# EAGLE design paperclick_v1 (EAGLE 9.6.2)
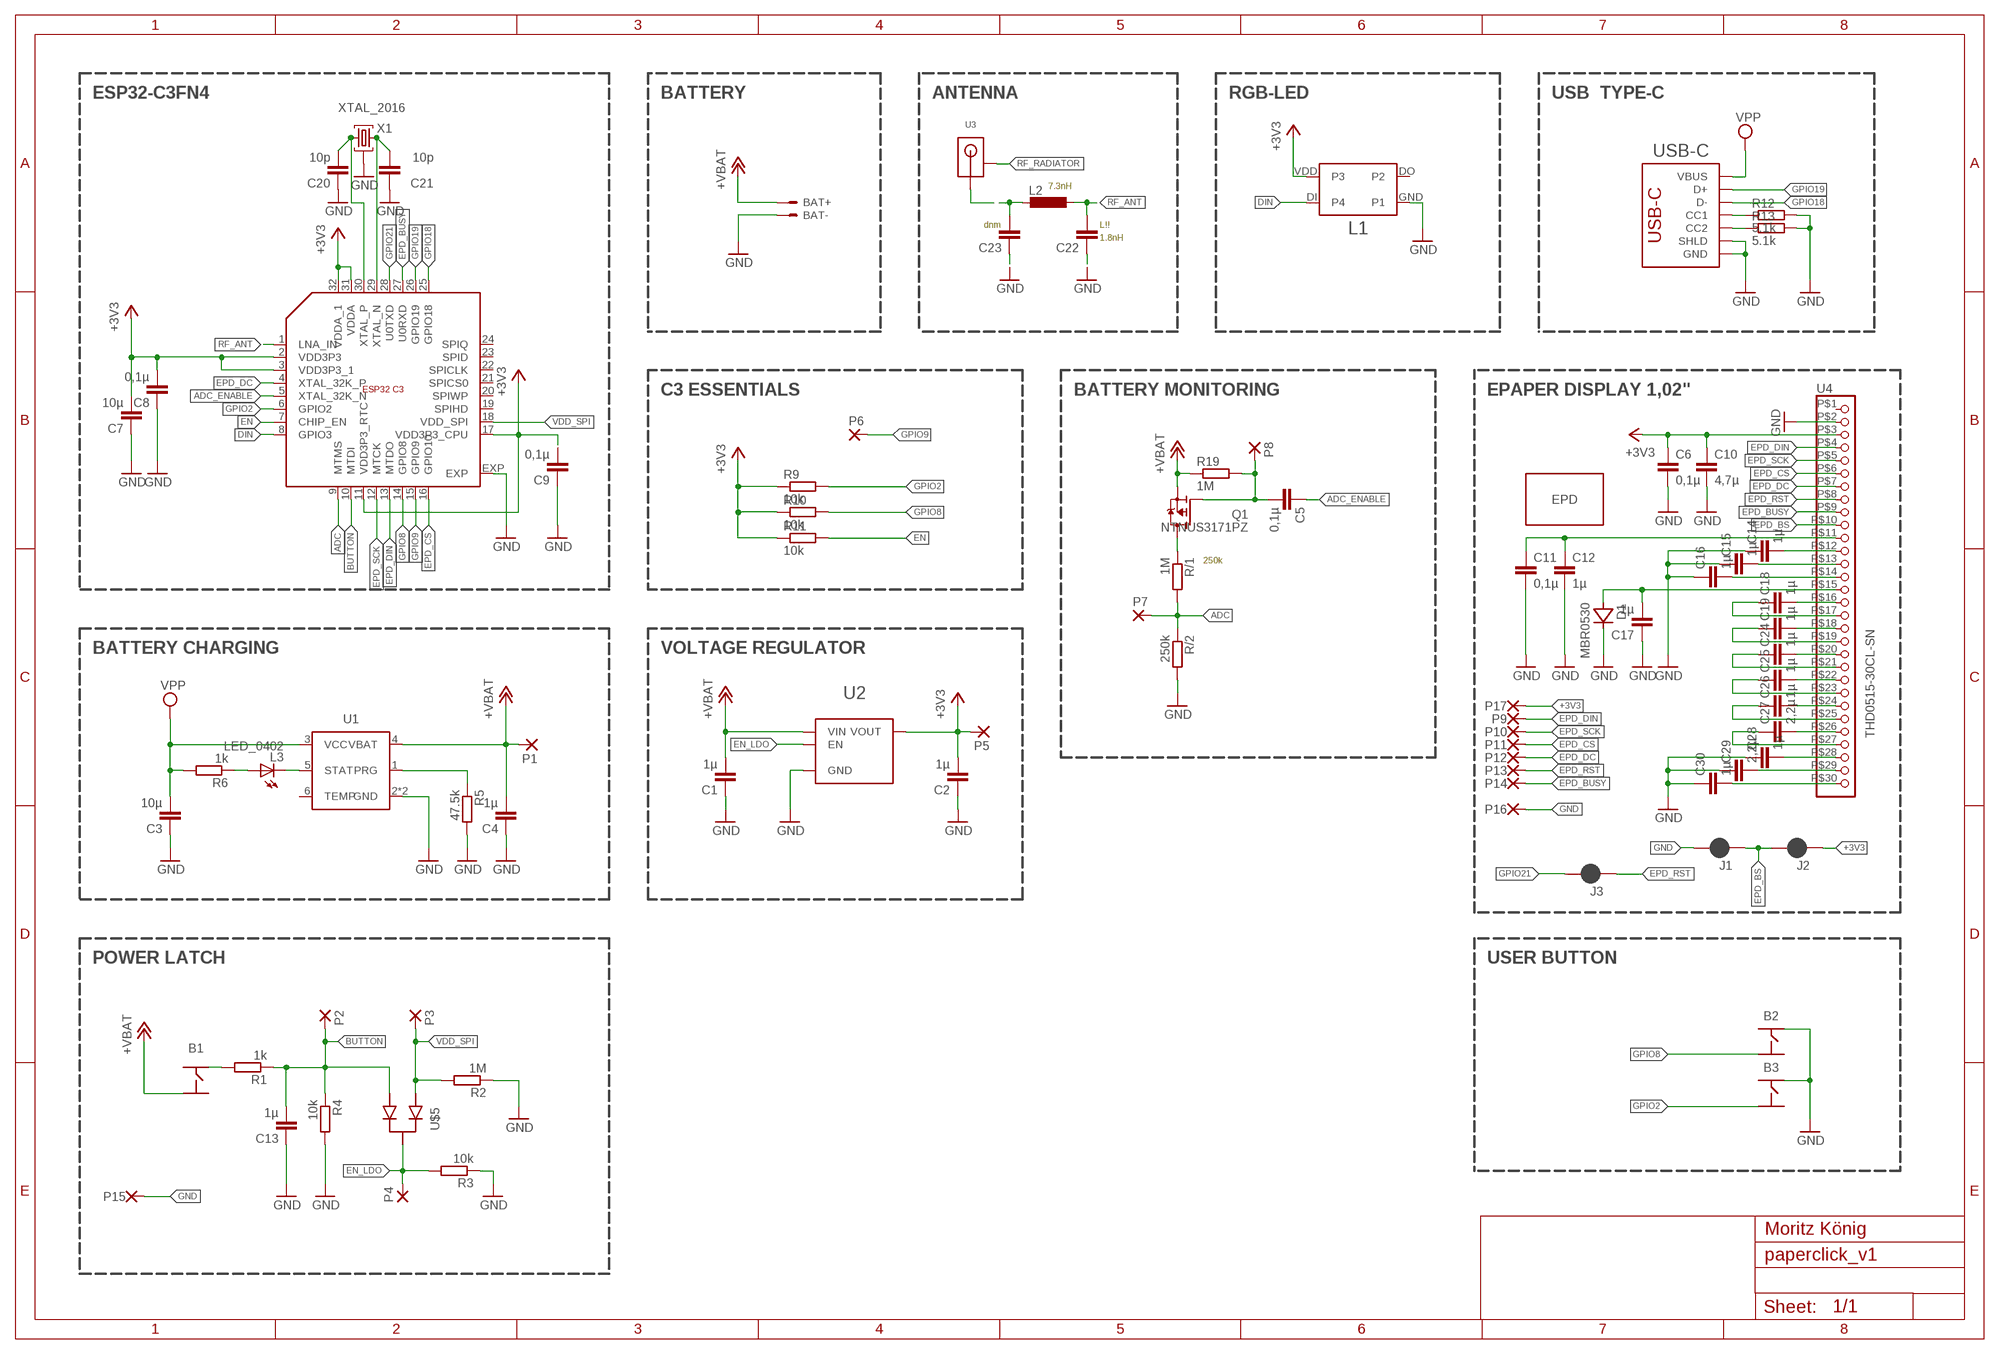
[diagram p0: schematic, sheet 1]

## Parts
B1  BUTTON_4PIN_TS-1070A  [BUTTON_WHITE_SMD]
B2  PTS840ESDGMSMTRLFS  [PTS840ESDGMSMTRLFS]
B3  PTS840ESDGMSMTRLFS  [PTS840ESDGMSMTRLFS]
BAT+  TP/SP-1.5X1.0  [SOLDERPAD_1.5X1.0]
BAT-  TP/SP-1.5X1.0  [SOLDERPAD_1.5X1.0]
C1  1µ  C0402_S  [C0402_S]
C2  1µ  C0402_S  [C0402_S]
C3  10µ  C0402_S  [C0402_S]
C4  1µ  C0402_S  [C0402_S]
C5  0,1µ  C0402_S  [C0402_S]
C6  0,1µ  C0402_S  [C0402_S]
C7  10µ  C0402_S  [C0402_S]
C8  0,1µ  C0402_S  [C0402_S]
C9  0,1µ  C0402_S  [C0402_S]
C10  4,7µ  C0402_S  [C0402_S]
C11  0,1µ  C0402_S  [C0402_S]
C12  1µ  C0402_S  [C0402_S]
C13  1µ  C0402_S  [C0402_S]
C14  1µ  C0402_S  [C0402_S]
C15  1µ  C0402_S  [C0402_S]
C16  1µ  C0402_S  [C0402_S]
C17  1µ  C0402_S  [C0402_S]
C18  1µ  C0402_S  [C0402_S]
C19  1µ  C0402_S  [C0402_S]
C20  10p  C0402_S  [C0402_S]
C21  10p  C0402_S  [C0402_S]
C22  C0201  [C0201]
C23  C0201  [C0201]
C24  1µ  C0402_S  [C0402_S]
C25  1µ  C0402_S  [C0402_S]
C26  1µ  C0402_S  [C0402_S]
C27  2,2µ  C0402_S  [C0402_S]
C28  1µ  C0402_S  [C0402_S]
C29  2,2µ  C0402_S  [C0402_S]
C30  1µ  C0402_S  [C0402_S]
D1  MBR0530  MBR0520  [SOD123]
ESP1  ESP32_C3_QFN32  [QFN32]
J1  SMT_JUMPER_2_NC_PASTE  [JUMPER_SMALL]
J2  SMT_JUMPER_2_NC_PASTE  [JUMPER_SMALL]
J3  SMT_JUMPER_2_NC_PASTE  [JUMPER_SMALL]
L1  WS2812_2020  [WS2812_2020]
L2  L0201  [L0201]
L3  LED_0402  [CHIPLED_0402]
P1  SMD-R1  [SMD-R1]
P2  SMD-R1  [SMD-R1]
P3  SMD-R1  [SMD-R1]
P4  SMD-R1  [SMD-R1]
P5  SMD-R1  [SMD-R1]
P6  SMD-R1  [SMD-R1]
P7  SMD-R1  [SMD-R1]
P8  SMD-R1  [SMD-R1]
P9  SMD-R1  [SMD-R1]
P10  SMD-R1  [SMD-R1]
P11  SMD-R1  [SMD-R1]
P12  SMD-R1  [SMD-R1]
P13  SMD-R1  [SMD-R1]
P14  SMD-R1  [SMD-R1]
P15  SMD-R1  [SMD-R1]
P16  SMD-R1  [SMD-R1]
P17  SMD-R1  [SMD-R1]
Q1  NTNUS3171PZ  [SOT1123]
R1  1k  R0402  [R0402]
R2  1M  R0402  [R0402]
R3  10k  R0402  [R0402]
R4  10k  R0402  [R0402]
R5  47.5k  R0402  [R0402]
R6  1k  R0402  [R0402]
R9  10k  R0402  [R0402]
R10  10k  R0402  [R0402]
R11  10k  R0402  [R0402]
R12  5.1k  R0402  [R0402]
R13  5.1k  R0402  [R0402]
R19  1M  R0402  [R0402]
R/1  1M  R0402  [R0402]
R/2  250k  R0402  [R0402]
U1  WS4518D  [DFN-6]
U2  MIC5504  [TDFN4]
U3  ANT016008LCS2442MA2  [ANT016008LCS2442MA2]
U4  THD0515-30CL-SN  [THD0515-30CL-SN]
U$2  EPD-102-30PIN-TW  [EPD-102-30PIN-TW]
U$5  DAN222  [SOT523]
USB-C  USB_C_C393939  [USBC_C393939]
X1  XTAL_2016  [XTAL_2016]

## Nets
+3V3: C2.P$2 C6.P$1 C7.P$2 C8.P$2 C9.P$2 C10.P$1 ESP1.2(VDD3P3) ESP1.3(VDD3P3_1) ESP1.11(VDD3P3_RTC) ESP1.17(VDD3P3_CPU) ESP1.31(VDDA) ESP1.32(VDDA_1) J2.P$1 L1.VDD(P3) P5.P$1(P) P17.P$1(P) R9.1 R10.1 R11.1 U2.P1(VOUT) U4.P$3
+VBAT: B1.P$2 BAT+.1(S) C1.P$2 C4.P$2 P1.P$1(P) Q1.2(S) R19.1 U1.4(VBAT) U2.P4(VIN)
ADC: ESP1.9(MTMS) P7.P$1(P) R/1.2 R/2.1
ADC_ENABLE: C5.P$1 ESP1.5(XTAL_32K_N)
BUTTON: C13.P$2 ESP1.10(MTDI) P2.P$1(P) R1.1 R4.1 U$5.2
DIN: ESP1.8(GPIO3) L1.DI(P4)
EN: ESP1.7(CHIP_EN) R11.2
EN_LDO: P4.P$1(P) R3.2 U2.P3(EN) U$5.3
EPD_BS: J1.P$1 J2.P$2 U4.P$10
EPD_BUSY: ESP1.27(U0RXD) P14.P$1(P) U4.P$9
EPD_CS: ESP1.16(GPIO10) P11.P$1(P) U4.P$6
EPD_DC: ESP1.4(XTAL_32K_P) P12.P$1(P) U4.P$7
EPD_DIN: ESP1.13(MTDO) P9.P$1(P) U4.P$4
EPD_RST: J3.P$1 P13.P$1(P) U4.P$8
EPD_SCK: ESP1.12(MTCK) P10.P$1(P) U4.P$5
GND: B2.2 B3.2 BAT-.1(S) C1.P$1 C2.P$1 C3.P$1 C4.P$1 C6.P$2 C7.P$1 C8.P$1 C9.P$1 C10.P$2 C11.P$2 C12.P$2 C13.P$1 C14.P$1 C15.P$1 C16.P$1 C17.P$1 C20.P$1 C21.P$1 C22.P$1 C23.P$1 C28.P$1 C29.P$1 C30.P$1 D1.P$2(C) ESP1.EXP J1.P$2 L1.GND(P1) P15.P$1(P) P16.P$1(P) R2.1 R3.1 R4.2 R5.2 R12.2 R13.2 R/2.2 U1.2(GND) U1.EXP(GND) U2.EXP(GND) U2.P2(GND) U4.P$2 USB-C.A1B12(GND) USB-C.B1A12(GND) USB-C.S1(SHLD) USB-C.S2(SHLD) USB-C.S3(SHLD) USB-C.S4(SHLD) X1.P2(G) X1.P4(G)
GPIO2: B3.3 ESP1.6(GPIO2) R9.2
GPIO8: B2.3 ESP1.14(GPIO8) R10.2
GPIO9: ESP1.15(GPIO9) P6.P$1(P)
GPIO18: ESP1.25(GPIO18) USB-C.A7(D-) USB-C.B7(D-)
GPIO19: ESP1.26(GPIO19) USB-C.A6(D+) USB-C.B6(D+)
GPIO21: ESP1.28(U0TXD) J3.P$2
N$1: B1.P$4 R1.2
N$2: L3.P$2(A) R6.1
N$3: L3.P$1(C) U1.5(STAT)
N$5: Q1.3(D) R/1.1
N$6: C23.P$2 L2.P$2 U3.3(ANT)
N$7: C5.P$2 P8.P$1(P) Q1.1(G) R19.2
N$18: R13.1 USB-C.B5(CC2)
N$19: C11.P$1 C12.P$1 U4.P$11
N$20: C14.P$2 U4.P$12
N$21: C15.P$2 U4.P$13
N$22: C16.P$2 U4.P$14
N$23: R5.1 U1.1(PRG)
N$24: C17.P$2 D1.P$1(A) U4.P$15
N$25: R12.1 USB-C.A5(CC1)
N$26: C20.P$2 ESP1.30(XTAL_P) X1.P1
N$27: C21.P$2 ESP1.29(XTAL_N) X1.P3
N$28: C18.P$2 U4.P$16
N$29: C18.P$1 U4.P$17
N$30: C19.P$2 U4.P$18
N$31: C19.P$1 U4.P$19
N$32: C24.P$2 U4.P$20
N$33: C24.P$1 U4.P$21
N$34: C25.P$2 U4.P$22
N$35: C25.P$1 U4.P$23
N$36: C26.P$2 U4.P$24
N$37: C26.P$1 U4.P$25
N$38: C27.P$2 U4.P$26
N$39: C27.P$1 U4.P$27
N$40: C28.P$2 U4.P$28
N$41: C29.P$2 U4.P$29
N$42: C30.P$2 U4.P$30
RF_ANT: C22.P$2 ESP1.1(LNA_IN) L2.P$1
RF_RADIATOR: U3.1(GND)
VDD_SPI: ESP1.18(VDD_SPI) P3.P$1(P) R2.2 U$5.1
VPP: C3.P$2 R6.2 U1.3(VCC) USB-C.A4B9(VBUS) USB-C.B4A9(VBUS)
Unconnected: B1.P$1 B1.P$3 B2.1 B2.4 B2.5 B3.1 B3.4 B3.5 ESP1.19(SPIHD) ESP1.20(SPIWP) ESP1.21(SPICS0) ESP1.22(SPICLK) ESP1.23(SPID) ESP1.24(SPIQ) L1.DO(P2) U1.6(TEMP) U4.P$1

## Notes on the sheet
- ESP32-C3FN4 | BATTERY | ANTENNA | RGB-LED | USB  TYPE-C
- 7.3nH
- dnm | L!!
- 1.8nH
- C3 ESSENTIALS | BATTERY MONITORING | EPAPER DISPLAY 1,02"
- 250k
- BATTERY CHARGING | VOLTAGE REGULATOR
- POWER LATCH | USER BUTTON
- Moritz König

## Library data of the parts
B1 = moekoe_switches:BUTTON_4PIN
B2 B3 = moekoe_switches:PTS840ESDGMSMTRLFS
BAT+ BAT- = iml_elc:TP/SP: Solderpads/Testpads
C1-C21 C24-C30 = moekoe_rcl:C0402
C22 C23 = moekoe_rcl:C0201
D1 = moekoe_discrete:MBR0520
ESP1 = moekoe_controllers:ESP32_C3_QFN32
J1-J3 = moekoe_pads_jumpers:SMT_JUMPER_2_NC_PASTE
L1 = moekoe_led:WS2812_2020
L2 = moekoe_rcl:L0201
L3 = moekoe_led:LED_0402
P1-P17 = moekoe_pads_jumpers:SMD-R1
Q1 = moekoe_discrete:NTNUS3171PZ
R1-R6 R9-R13 R19 R/1 R/2 = moekoe_rcl:R0402
U1 = moekoe_ics:WS4518D
U2 = moekoe_ics:MIC5504
U3 = moekoe_antennas:ANT016008LCS2442MA2
U4 = moekoe_hardware:THD0515-30CL-SN
U$2 = moekoe_displays:EPD-102-30PIN
U$5 = moekoe_discrete:DAN222
USB-C = moekoe_hardware:USB_C_C393939
X1 = moekoe_discrete:XTAL_2016

## Board
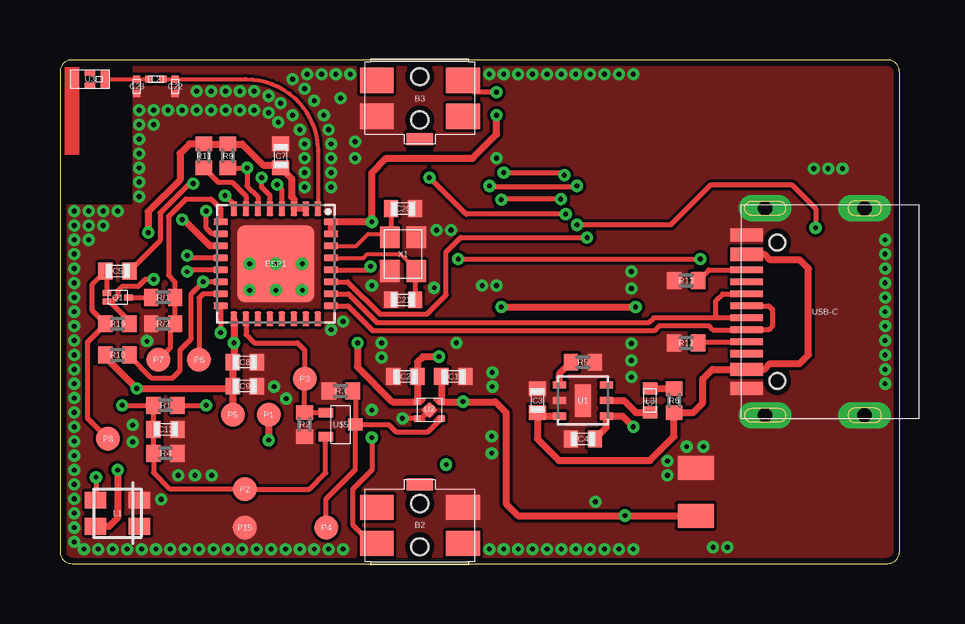
[diagram p1: board, top side]
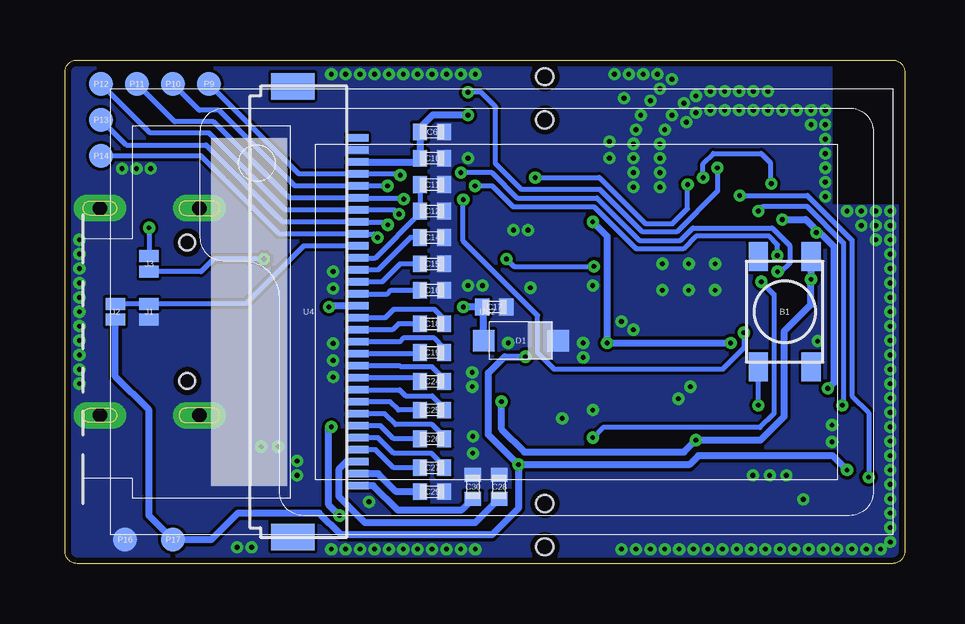
[diagram p2: board, bottom side, seen from below]

Size 35 x 21 mm. Coordinates in mm from the lower left corner, seen from the top.
Outline: 0.5,0 34.5,0 arc90 35,0.5 35,20.5 arc90 34.5,21 0.5,21 arc90 0,20.5 0,0.5 arc90 0.5,0
Copper layers (1*16): Top 0.035mm / dielectric 0.93mm / Bottom 0.035mm
Design rules "2020.08.24_4layers_eagle *": minimum track width 6mil, minimum drill 0.2mm, track to track 5mil, track to pad 4mil, pad to pad 4mil, via to via 5mil, smd to smd 0.1mm, copper to edge 10mil, drill to drill 6mil, minimum pad ring 10mil, minimum via ring 6mil, stop-mask expansion 0mil, vias tented up to drill 0.5mm, thermal gap 4mil
tRestrict: area 0,15 to 3,21
bRestrict: area 0,15 to 3,21

### Footprints (pad centres in the part's own frame; a part is rotated, then mirrored left to right if it is on the bottom)
BUTTON_WHITE_SMD = smd 1.2 x 0.8: P$1 2.3,1.1; P$2 2.3,-1.1; P$3 -2.3,-1.1; P$4 -2.3,1.1
PTS840ESDGMSMTRLFS = smd 1.4 x 1.05: 1 -1.8,0.75; 2 1.8,0.75; 3 -1.8,-0.75; 4 1.8,-0.75 | smd 1.1 x 0.5: 5 0,1.7 | hole 0.7: 0,0.9; 0,-0.9
SOLDERPAD_1.5X1.0 = smd 1 x 1.5: 1 0,0
C0402_S = smd 0.6 x 0.7: P$1 -0.5,0; P$2 0.5,0
C0201 = smd 0.3 x 0.3: P$1 -0.3,0; P$2 0.3,0
SOD123 = smd 0.9 x 0.9: P$1 -1.55,0; P$2 1.55,0
QFN32 = smd 0.6 x 0.275: 1 -2.3,1.75; 2 -2.3,1.25; 3 -2.3,0.75; 4 -2.3,0.25; 5 -2.3,-0.25; 6 -2.3,-0.75; 7 -2.3,-1.25; 8 -2.3,-1.75; 17 2.3,-1.75; 18 2.3,-1.25; 19 2.3,-0.75; 20 2.3,-0.25; 21 2.3,0.25; 22 2.3,0.75; 23 2.3,1.25; 24 2.3,1.75 | smd 0.275 x 0.6: 9 -1.75,-2.3; 10 -1.25,-2.3; 11 -0.75,-2.3; 12 -0.25,-2.3; 13 0.25,-2.3; 14 0.75,-2.3; 15 1.25,-2.3; 16 1.75,-2.3; 25 1.75,2.3; 26 1.25,2.3; 27 0.75,2.3; 28 0.25,2.3; 29 -0.25,2.3; 30 -0.75,2.3; 31 -1.25,2.3; 32 -1.75,2.3 | smd 3.2 x 3.2: EXP 0,0
JUMPER_SMALL = smd 0.5 x 0.8: P$1 -0.33,0; P$2 0.33,0
WS2812_2020 = smd 0.9 x 0.7: DI -0.915,0.55; DO 0.915,-0.55; GND 0.915,0.55; VDD -0.915,-0.55
L0201 = smd 0.3 x 0.3: P$1 -0.3,0; P$2 0.3,0
CHIPLED_0402 = smd 0.5 x 0.6: P$1 -0.5,0; P$2 0.5,0
SMD-R1 = smd 1 x 1: P$1 0,0
SOT1123 = smd 0.35 x 0.25: 1 -0.45,0.175; 2 -0.45,-0.175; 3 0.45,0
R0402 = smd 0.6 x 0.7: 1 -0.5,0; 2 0.5,0
DFN-6 = smd 0.55 x 0.3: 1 -0.975,0.65; 2 -0.975,0; 3 -0.975,-0.65; 4 0.975,-0.65; 5 0.975,0; 6 0.975,0.65 | smd 0.65 x 1.35: EXP 0,0
TDFN4 = smd 0.48 x 0.48 rotated 45: EXP 0,0 | smd 0.25 x 0.3: P1 -0.35,-0.5; P2 0.35,-0.5; P3 0.35,0.5; P4 -0.35,0.5
ANT016008LCS2442MA2 = smd 0.35 x 0.8: 1 -0.625,0; 3 0.625,0 | smd 0.45 x 0.2: 2 0,0.254; 4 0,-0.254
THD0515-30CL-SN = smd 0.9 x 0.3: P$1 0,7.25; P$2 0,6.75; P$3 0,6.25; P$4 0,5.75; P$5 0,5.25; P$6 0,4.75; P$7 0,4.25; P$8 0,3.75; P$9 0,3.25; P$10 0,2.75; P$11 0,2.25; P$12 0,1.75; P$13 0,1.25; P$14 0,0.75; P$15 0,0.25; P$16 0,-0.25; P$17 0,-0.75; P$18 0,-1.25; P$19 0,-1.75; P$20 0,-2.25; P$21 0,-2.75; P$22 0,-3.25; P$23 0,-3.75; P$24 0,-4.25; P$25 0,-4.75; P$26 0,-5.25; P$27 0,-5.75; P$28 0,-6.25; P$29 0,-6.75; P$30 0,-7.25 | smd 1.8 x 1.1: P$31 -2.7,-9.4; P$32 -2.7,9.4
SOT523 = smd 0.4 x 0.6: 1 0.5,0.62; 2 -0.5,0.62 | smd 0.5 x 0.6: 3 0,-0.62
USBC_C393939 = smd 0.55 x 1.35: A1B12 -3.2,0.775; A4B9 -2.4,0.775; B1A12 3.2,0.775; B4A9 2.4,0.775 | smd 0.275 x 1.35: A5 -1.25,0.775; A6 -0.25,0.775; A7 0.25,0.775; B5 1.75,0.775; B6 0.75,0.775; B7 -0.75,0.775; B8 1.25,0.775 | smd 0.3 x 1.35: A8 -1.75,0.775 | drill 0.6 pad 1 long: S1 -4.32,0; S2 4.32,0; S3 -4.32,-4.15; S4 4.32,-4.15 | hole 0.65: 2.89,-0.5; -2.89,-0.5
XTAL_2016 = smd 0.9 x 0.8: P1 -0.7,-0.55; P2 0.7,-0.55; P3 0.7,0.55; P4 -0.7,0.55

### Placement (x,y rotation side)
B1  5,10.5 90 bottom
B2  15,1.6 0 top
B3  15,19.4 180 top
BAT+  26.5,2 90 top
BAT-  26.5,4 90 top
C1  16.4,7.8 180 top
C2  14.4,7.8 0 top
C3  19.9,6.8 270 top
C4  21.8,5.2 0 top
C5  2.4,12.2 180 top
C6  19.7,18 0 bottom
C7  9.2,17 270 top
C8  7.7,8.4 180 top
C9  7.7,7.4 180 top
C10  19.7,16.9 0 bottom
C11  19.7,15.8 0 bottom
C12  19.7,14.7 0 bottom
C13  4.4,5.6 180 top
C14  19.7,13.6 180 bottom
C15  19.7,12.5 180 bottom
C16  19.7,11.4 180 bottom
C17  17.1,10.7 180 bottom
C18  19.7,10 0 bottom
C19  19.7,8.8 0 bottom
C20  14.3,14.8 180 top
C21  14.3,11 0 top
C22  4.8,19.9 90 top
C23  3.2,19.9 90 top
C24  19.7,7.6 0 bottom
C25  19.7,6.4 0 bottom
C26  19.7,5.2 0 bottom
C27  19.7,4 0 bottom
C28  16.9,3.2 270 bottom
C29  19.7,3 180 bottom
C30  18,3.2 270 bottom
D1  16,9.3 0 bottom
ESP1  9,12.5 270 top
J1  31.5,10.5 270 bottom
J2  32.9,10.5 90 bottom
J3  31.5,12.5 270 bottom
L1  2.4,2.1 0 top
L2  4,20.2 180 top
L3  24.6,6.8 90 top
P1  8.7,6.2 0 top
P2  7.7,3.1 0 top
P3  10.2,7.7 0 top
P4  11.1,1.5 0 top
P5  7.2,6.2 0 top
P6  5.8,8.5 0 top
P7  4.1,8.5 0 top
P8  2,5.2 0 top
P9  29,20 0 bottom
P10  30.5,20 0 bottom
P11  32,20 0 bottom
P12  33.5,20 0 bottom
P13  33.5,18.5 0 bottom
P14  33.5,17 0 bottom
P15  7.7,1.5 0 top
P16  32.5,1 0 bottom
P17  30.5,1 0 bottom
Q1  2.4,11.1 0 top
R1  4.4,6.6 0 top
R2  10.2,5.8 90 top
R3  11.7,7.2 0 top
R4  4.4,4.6 0 top
R5  21.8,8.4 0 top
R6  25.6,6.8 270 top
R9  7,17 270 top
R10  2.4,8.7 0 top
R11  6,17 270 top
R12  26.1,9.2 180 top
R13  26.1,11.8 180 top
R19  2.4,10 180 top
R/1  4.3,11.1 0 top
R/2  4.3,10 180 top
U1  21.8,6.8 0 top
U2  15.4,6.4 270 top
U3  1.25,20.2 0 top
U4  22.8,10.5 0 bottom
U$2  16.8,10.5 180 bottom
U$5  11.7,5.8 90 top
USB-C  29.4,10.5 90 top
X1  14.3,12.9 270 top

### Tracks (layer width: path | path; a pad name or v marks a point on that pad's centre or on a via)
+3V3  (via drill 0.2 pad 0.4)
  Top 0.3: ESP1.2 ESP1.3 9.75,15.19 9.65,15.29 9.65,16.05 C7.P$2 9.07,16.62 8.47,16.62 7.6,17.5 R9.1 R11.1 5.4,17.5 5,17.1 5,15.99 3.68,14.67 v3.68,13.8 | ESP1.31 ESP1.32 v13,14.25 13,16.3 13.6,16.9 17.2,16.9 18.2,17.9 v18.2,18.7 | v12.4,9.2 12.4,8.2 13.85,6.75 U2.P1 C2.P$2 14.9,8.4 15.12,8.62 v15.8,8.62 | ESP1.17 v7.25,9.2 7.25,8.45 C8.P$2 C9.P$2 | C9.P$2 P5.P$1 | ESP1.11 6.25,13.25 5.15,14.35 v5.1,14.35 | R10.1 1.9,8.6 v3.2,7.3 7.2,7.3 C9.P$2 | v2.4,3.9 2.4,1.9 2.05,1.55 L1.VDD
  Bottom 0.3: U4.P$3 20.35,16.75 C10.P$1 C6.P$1 20.2,18.18 19.68,18.7 v18.2,18.7 | v13,14.25 12.4,13.65 v12.4,9.2 v7.25,9.2 | v16.1,4.12 17.35,5.38 17.35,7.95 16.68,8.62 v15.8,8.62 | J2.P$1 32.9,7.8 31.5,6.4 31.5,2 P17.P$1 28.9,1 27.8,2.1 24.4,2.1 23.5,1.2 17.2,1.2 16.1,2.3 v16.1,4.12 | v5.1,14.35 4.12,14.35 3.68,13.9 v3.68,13.8 3.53,13.8 2.95,13.22 2.95,7.55 v3.2,7.3 | v2.4,3.9 3,4.5 8.6,4.5 8.97,4.12 v16.1,4.12
+VBAT  (via drill 0.2 pad 0.4)
  Top 0.2: R19.1 2.9,10.1 2.07,10.93 Q1.2 2.18,10.93 2.4,11.14 2.4,11.38 2.57,11.55 3.25,11.55 3.55,11.85 v3.9,11.85
  Top 0.3: C1.P$2 U2.P4 v16.8,6.75 18.15,6.75 18.6,6.3 18.6,2.5 19.1,2 v23.55,2 BAT+.1 | C4.P$2 22.77,5.67 U1.4 23.45,6.15 v23.9,5.7 | P1.P$1 v8.7,5.15
  Bottom 0.2: 3.9,11.9 v3.9,11.85
  Bottom 0.3: v16.8,6.75 16.8,5.6 15.85,4.65 9.2,4.65 v8.7,5.15 6,5.15 5.03,6.12 5.03,9.68 3.9,10.8 v3.9,11.85 | B1.P$2 3.9,11.9 | v23.9,5.7 24.02,5.58 24.02,2.47 v23.55,2
ADC
  Top 0.2: P7.P$1 4.6,9 4.6,9.8 R/2.1 R/1.2 4.8,11.75 4.53,12.03 4.53,14.47 5.25,15.2 6.3,15.2 6.7,14.8 ESP1.9
ADC_ENABLE  (via drill 0.2 pad 0.4)
  Top 0.2: ESP1.5 8.75,15.35 8.4,15.7 v8.4,16.1 | C5.P$1 4.18,13.47 4.18,14.62 5.4,15.85 v5.55,15.85
  Bottom 0.2: v8.4,16.1 8.4,16.68 7.97,17.1 5.97,17.1 5.6,16.73 5.6,15.89 v5.55,15.85
BUTTON  (via drill 0.2 pad 0.4)
  Top 0.2: v2.6,6.6 R1.1 C13.P$2 R4.1 3.9,3.8 4.6,3.1 P2.P$1 10.4,3.1 11.08,3.78 U$5.2 | ESP1.10 6.35,13.75 6.1,14 v6.1,14.7
  Bottom 0.2: v6.1,14.7 5.9,14.9 4.07,14.9 2.55,13.38 2.55,6.65 v2.6,6.6
DIN  (via drill 0.2 pad 0.4)
  Top 0.2: ESP1.8 7.25,14.97 v6.88,15.35 | v1.5,3.6 1.5,2.67 L1.DI
  Bottom 0.2: v6.88,15.35 4.05,15.35 2.2,13.5 2.2,7 1.5,6.3 v1.5,3.6
EN
  Top 0.2: R11.2 6.6,15.9 7.18,15.9 7.75,15.33 ESP1.7
EN_LDO
  Top 0.2: R3.2 12.32,7.08 U$5.3 | U$5.3 13.7,5.8 14,5.5 15.35,5.5 U2.P3 | P4.P$1 11.1,2.7 12.32,3.92 U$5.3
EPD_BS
  Bottom 0.2: U4.P$10 25.05,13.25 27.47,10.83 J1.P$1 J2.P$2
EPD_BUSY  (via drill 0.2 pad 0.4)
  Top 0.2: ESP1.27 12,11.75 13.35,10.4 15.3,10.4 16.1,11.2 16.1,13 16.7,13.6 v21.98,13.6
  Bottom 0.2: P14.P$1 29.32,17 26.07,13.75 U4.P$9 22.12,13.75 v21.98,13.6
EPD_CS  (via drill 0.2 pad 0.4)
  Top 0.2: v18.4,15.18 18.42,15.19 v20.88,15.19 | ESP1.16 v6.7,9.62
  Bottom 0.2: P11.P$1 30.43,18.43 28.81,18.43 25.63,15.25 U4.P$6 20.93,15.25 v20.88,15.19 | v6.7,9.62 6.7,9 7.6,8.1 14.6,8.1 15.3,8.8 15.3,10.35 18.4,13.45 v18.4,15.18
EPD_DC  (via drill 0.2 pad 0.4)
  Top 0.2: ESP1.4 9.25,15.6 v9.05,15.8 | v21.08,14.57 16.93,14.57 v15.4,16.1
  Bottom 0.2: P12.P$1 31.45,17.95 29,17.95 25.8,14.75 U4.P$7 21.26,14.75 v21.08,14.57 | v15.4,16.1 12.72,16.1 10.8,14.18 9.67,14.18 9.05,14.8 v9.05,15.8
EPD_DIN  (via drill 0.2 pad 0.4)
  Top 0.2: ESP1.13 5.38,12.25 v5.29,12.17 | v18.5,16.3 20.92,16.3 v21.02,16.2
  Bottom 0.2: P9.P$1 25.25,16.25 U4.P$4 21.08,16.25 v21.02,16.2 | v18.5,16.3 17.2,16.3 16.15,15.25 12.82,15.25 11.05,13.47 9.35,13.47 8.83,14 5.52,14 4.79,13.27 4.79,12.5 5.13,12.17 v5.29,12.17
  Bottom 0.3: P9.P$1
EPD_RST  (via drill 0.2 pad 0.4)
  Top 0.2: v21.55,14.13 25.47,14.13 27.14,15.8 30.5,15.8 31.5,14.8 v31.5,14
  Bottom 0.2: P13.P$1 32.45,17.45 29.12,17.45 25.93,14.25 U4.P$8 21.67,14.25 v21.55,14.13 | v31.5,14 J3.P$1
EPD_SCK  (via drill 0.2 pad 0.4)
  Top 0.2: ESP1.12 5.4,12.75 v5.3,12.85 | v21.55,15.75 21.5,15.7 17.96,15.7 v17.91,15.75
  Bottom 0.2: P10.P$1 29.4,18.9 28.57,18.9 25.42,15.75 U4.P$5 v21.55,15.75 | v5.3,12.85 5.3,13.3 5.65,13.65 8.7,13.65 9.22,13.12 11.19,13.12 12.94,14.88 16.32,14.88 17.19,15.75 v17.91,15.75
GND  (via drill 0.2 pad 0.4)
  Top 0.2: U2.EXP 15.05,6.05 U2.P2 v14.28,6.05
  other vias: 13,11.6 16.3,13.9 15.7,13.9 13.4,8.6 13.4,9.2 18,4.6 18,5.3 15.6,11.5 18.2,11.6 17.6,11.6 16.52,9.2 9,12.5 11.8,10.1 11.3,9.75 18.2,16.9 13,6.4 0.6,14.7 1.2,14.7 1.8,14.7 2.4,14.7 3.3,15.3 3.3,15.9 3.3,16.5 3.3,17.1 3.3,17.7 3.3,18.3 3.3,18.9 3.9,18.9 4.5,18.9 5.1,18.9 5.7,18.9 5.7,19.7 6.3,19.7 6.9,19.7 7.5,19.7 8.1,19.7 8.7,19.5 9.2,19.2 9.7,18.7 10,18.1 10.2,17.5 10.2,16.9 10.2,16.3 10.2,15.7 11.3,15.7 11.3,16.3 11.3,16.9 11.3,17.5 11.2,18.1 11,18.7 10.6,19.3 10.2,19.8 9.7,20.2 10.3,20.4 10.9,20.4 11.5,20.4 12.1,20.4 6.3,18.9 6.9,18.9 7.5,18.9 8.1,18.9 8.7,18.8 9.1,18.4 0.6,14.1 0.6,13.5 0.6,12.9 0.6,12.3 1.2,14.1 1.8,14.1 1.2,13.5 7.9,12.5 10.1,12.5 10.1,11.4 9,11.4 7.9,11.4 0.6,11.7 0.6,11.1 0.6,10.5 0.6,9.9 0.6,9.3 0.6,8.7 0.6,8.1 0.6,7.5 0.6,6.9 0.6,6.3 0.6,5.7 0.6,5.1 0.6,4.5 0.6,3.9 0.6,3.3 0.6,2.7 0.6,2.1 0.6,1.5 2.2,0.6 1.6,0.6 2.8,0.6 3.4,0.6 4,0.6 4.6,0.6 5.2,0.6 5.8,0.6 6.4,0.6 7,0.6 7.6,0.6 8.2,0.6 8.8,0.6 9.4,0.6 10,0.6 10.6,0.6 11.2,0.6 11.8,0.6 17.9,0.6 18.5,0.6 19.1,0.6 19.7,0.6 20.3,0.6 20.9,0.6 21.5,0.6 22.1,0.6 22.7,0.6 23.3,0.6 23.9,0.6 17.9,20.4 18.5,20.4 19.1,20.4 19.7,20.4 20.3,20.4 20.9,20.4 21.5,20.4 22.1,20.4 22.7,20.4 23.3,20.4 23.9,20.4 3.9,18.3 8.93,7.38 9.43,6.88 4.93,3.67 5.62,3.67 6.32,3.67 3.03,5.78 3.03,5.08 4.22,2.67 18.02,7.38 18.02,7.97 31.43,16.48 32.02,16.48 32.62,16.48 26.12,4.88 26.82,4.88 25.32,3.67 25.32,4.28 11.7,19.4 12.3,16.9 12.3,17.6 23.82,12.18 23.82,11.47 23.82,9.18 23.82,8.47 23.82,7.78 22.32,2.58 34.4,10.5 34.4,11.1 34.4,11.7 34.4,12.3 34.4,12.9 34.4,13.5 34.4,9.9 34.4,9.3 34.4,8.7 34.4,8.1 34.4,7.5 0.6,0.9 1,0.6 3.62,9.28 27.23,0.68 27.82,0.68
  pour Top (rank 3, no thermals): 2.8,21.4 2.8,15.1 -0.7,15.1 -0.7,-0.2 35.2,-0.2 35.2,21.4
  pour Bottom (rank 3, no thermals): 2.8,21.6 2.8,15.1 -0.7,15.1 -0.7,-0.2 35.2,-0.2 35.2,21.6
GPIO2  (via drill 0.2 pad 0.4)
  Top 0.2: R9.2 v7.8,16.5 7.8,15.75 8.25,15.3 ESP1.6 | v18.2,19.65 17.3,19.65 B3.3
  Bottom 0.2: v7.8,16.5 7.8,15.53 9.5,13.82 10.92,13.82 12.7,15.6 15.97,15.6 17.05,16.68 17.05,19.05 17.65,19.65 v18.2,19.65
GPIO8  (via drill 0.2 pad 0.4)
  Top 0.2: R10.2 2.9,8.65 3.8,7.75 4.7,7.75 5,8.05 5,8.9 5.47,9.37 5.47,11.25 v5.97,11.75 ESP1.14 | v13,5.25 13,3.9 12.2,3.1 12.2,1.62 12.97,0.85 B2.3
  Bottom 0.2: v5.97,11.75 5.45,11.23 5.45,6.25 6.03,5.67 12.57,5.67 v13,5.25
GPIO9
  Top 0.2: ESP1.15 5.97,11.25 5.8,11.08 P6.P$1
GPIO18
  Top 0.2: ESP1.25 12,10.75 13.05,9.7 24.77,9.7 24.98,9.9 27.07,9.9 27.23,9.75 USB-C.B7 29.55,9.75 29.7,9.9 29.7,10.6 29.55,10.75 USB-C.A7
GPIO19
  Top 0.2: ESP1.26 12.02,11.25 13.22,10.05 24.55,10.05 24.75,10.25 27.35,10.25 | USB-C.A6 27.35,10.25 | 27.35,10.25 27.35,10.97 27.62,11.25 USB-C.B6
GPIO21  (via drill 0.2 pad 0.4)
  Top 0.2: ESP1.28 12.8,12.25 v12.95,12.39 | v16.6,12.7 v26.7,12.7
  Bottom 0.2: v16.6,12.7 16.29,12.39 v12.95,12.39 | v26.7,12.7 28.8,12.7 29.33,12.17 J3.P$2
N$1  (via drill 0.2 pad 0.4)
  Top 0.2: R1.2 v6.1,6.6
  Bottom 0.2: v6.1,6.6 B1.P$4
N$2
  Top 0.3: L3.P$2 R6.1
N$3
  Top 0.3: U1.5 23.5,6.8 24,6.3 L3.P$1
N$5
  Top 0.2: Q1.3 R/1.1
N$6
  Top 0.16: U3.3 C23.P$2 L2.P$2
N$7
  Top 0.2: Q1.1 1.95,12.15 C5.P$2 1.35,11.65 1.35,10.55 R19.2 1.15,9.25 1.15,6.05 P8.P$1
N$18
  Top 0.2: R13.1 27.05,12.25 USB-C.B5
N$19
  Bottom 0.2: U4.P$11 22.07,12.75 20.2,14.62 C12.P$1 C11.P$1
N$20
  Bottom 0.2: C14.P$2 20.6,13.6 21.95,12.25 U4.P$12
N$21
  Bottom 0.2: C15.P$2 21.02,12.5 21.77,11.75 U4.P$13
N$22
  Bottom 0.2: U4.P$14 21.55,11.25 21.4,11.4 C16.P$2
N$23
  Top 0.3: U1.1 20.82,7.92 R5.1
N$24  (via drill 0.2 pad 0.4)
  Top 0.3: v18.4,10.7 v24,10.7
  Bottom 0.3: v18.4,10.7 C17.P$2 17.55,10.65 D1.P$1 | U4.P$15 23.95,10.75 v24,10.7
N$25
  Top 0.2: R12.1 26.65,9.25 USB-C.A5
N$26
  Top 0.16: ESP1.30 12.35,13.25 12.85,13.75 13.6,13.75 X1.P1
  Top 0.2: C20.P$2 13.8,13.65 X1.P1
N$27
  Top 0.16: ESP1.29 12.65,12.75 12.8,12.9 14.2,12.9 14.85,12.25 X1.P3
  Top 0.2: X1.P3 14.8,12.15 C21.P$2
N$28
  Bottom 0.2: C18.P$2 19.2,10.2 19.6,10.6 21.3,10.6 21.65,10.25 U4.P$16
N$29
  Bottom 0.2: C18.P$1 21.1,10 21.35,9.75 U4.P$17
N$30
  Bottom 0.2: C19.P$2 19.2,9 19.6,9.4 20.9,9.4 21.05,9.25 U4.P$18
N$31
  Bottom 0.2: 20.25,8.75 U4.P$19
  Bottom 0.3: C19.P$1 20.25,8.75
N$32
  Bottom 0.2: U4.P$20 21.05,8.25 21,8.2 19.7,8.2 19.2,7.7
  Bottom 0.3: C24.P$2 19.2,7.7
N$33
  Bottom 0.2: 20.35,7.75 U4.P$21
  Bottom 0.3: C24.P$1 20.35,7.75
N$34
  Bottom 0.2: U4.P$22 21.05,7.25 20.8,7 19.7,7 19.2,6.5
  Bottom 0.3: 19.2,6.5 C25.P$2
N$35
  Bottom 0.2: C25.P$1 21.1,6.4 21.45,6.75 U4.P$23
N$36
  Bottom 0.2: U4.P$24 21.68,6.25 21.23,5.8 19.7,5.8 19.2,5.3
  Bottom 0.3: C26.P$2 19.2,5.3
N$37
  Bottom 0.2: C26.P$1 21.3,5.2 21.85,5.75 U4.P$25
N$38
  Bottom 0.2: U4.P$26 21.95,5.25 21.3,4.6 19.73,4.6 19.2,4.08
  Bottom 0.3: C27.P$2 19.2,4.08
N$39
  Bottom 0.2: C27.P$1 21.3,4 22.05,4.75 U4.P$27
N$40
  Bottom 0.3: U4.P$28 23.27,4.25 23.57,3.95 23.57,2.78 22.5,1.7 17.9,1.7 C28.P$2
N$41
  Bottom 0.3: C29.P$2 21.2,3 21.95,3.75 U4.P$29
N$42
  Bottom 0.3: C30.P$2 18.48,2.22 21.12,2.22 22.15,3.25 U4.P$30
RF_ANT
  Top 0.16: L2.P$1 C22.P$2 7.75,20.2 arc-90 10.75,17.2 ESP1.1
VDD_SPI
  Top 0.2: U$5.1 R2.2 P3.P$1 10.2,8.9 9.9,9.2 8.1,9.2 7.75,9.55 ESP1.18
VPP
  Top 0.3: U1.3 20.05,6.15 C3.P$2 19.9,5.2 20.8,4.3 24.6,4.3 25.6,5.3 R6.2 26.4,6.3 26.8,6.7 26.8,7.7 27.2,8.1 USB-C.A4B9 29.36,8.1 29.6,8.34 30.84,8.34 31.2,8.7 31.2,12.3 30.84,12.66 29.6,12.66 29.36,12.9 USB-C.B4A9
(copper drawn outside any net)
  shapes: Top area x1

### Text on the board
tStop: @maker.moekoe | - | + | Paperclick
bStop: Paperclick / 01.03.22
bSilkNew: Picoclick v3 / @maker.moekoe / 14.11.2021